# EAGLE schematic main (EAGLE 7.2.0)
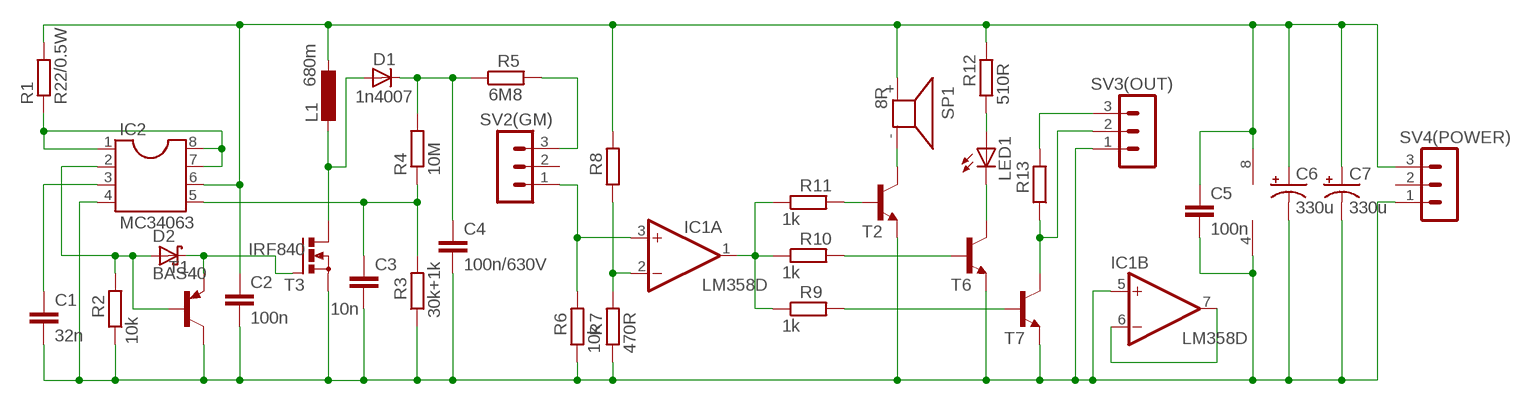
[diagram p0: schematic, sheet 1]

## Parts
C1  32n  C-EU050-025X075  [C050-025X075]
C2  100n  C-EUC3216  [C3216]
C3  10n  C-EU050-025X075  [C050-025X075]
C4  100n/630V  C-EU102-064X133  [C102-064X133]
C5  100n  C-EUC3216  [C3216]
C6  330u  CPOL-USA/3216-18W  [A/3216-18W]
C7  330u  CPOL-USA/3216-18W  [A/3216-18W]
D1  1n4007  1N4004  [DO41-10]
D2  BAS40  [SOT23]
IC1  LM358D  [SO08]
IC2  MC34063  DIL8  [DIL08]
L1  680m  L-EU0207/5V  [0207/5V]
LED1  LEDSFH482  [SFH482]
R1  R22/0.5W  R-EU_0207/5V  [0207/5V]
R2  10k  R-EU_R1206  [R1206]
R3  30k+1k  R-EU_0207/5V  [0207/5V]
R4  10M  R-EU_0207/5V  [0207/5V]
R5  6M8  R-EU_0207/12  [0207/12]
R6  10k  R-EU_0207/5V  [0207/5V]
R7  470R  R-EU_0207/5V  [0207/5V]
R8  R-EU_R1206  [R1206]
R9  1k  R-EU_M1206  [M1206]
R10  1k  R-EU_M1206  [M1206]
R11  1k  R-EU_M1206  [M1206]
R12  510R  R-EU_M1206  [M1206]
R13  R-EU_M1206  [M1206]
SP1  8R  KSS1201  [KSS1201]
SV2(GM)  MA03-1  [MA03-1]
SV3(OUT)  MA03-1  [MA03-1]
SV4(POWER)  MA03-1  [MA03-1]
T1  BC807-40-PNP-SOT23-BEC  [SOT23-BEC]
T2  BC848ALT1SMD  [SOT23]
T3  IRF840  BUZ11BV  [TO220BV]
T6  BC848ALT1SMD  [SOT23]
T7  BC848ALT1SMD  [SOT23]

## Nets
N$1: R9.2 T7.1(B)
N$2: R10.2 T6.1(B)
N$3: LED1.K(C) T6.3(C)
N$4: R13.1 SV3(OUT).2 T7.3(C)
N$5: C1.1 IC2.3
N$6: LED1.A R12.1
N$8: IC1.1(A:OUT) R9.1 R10.1 R11.1
N$9: SP1.- T2.3(C)
N$10: R11.2 T2.1(B)
N$11: IC2.1 IC2.7 IC2.8 R1.1
N$12 [hv]: C4.1 D1.C R4.2 R5.1
N$13: C3.1 IC2.5 R3.2 R4.1
N$14: D2.1(A) IC2.2 R2.2 T1.B
N$15 [hv]: D1.A L1.2 T3.D
N$16: D2.3(C) T1.E T3.G
N$17: IC1.3(A:+IN) R6.2 SV2(GM).1
N$19: IC1.2(A:-IN) R7.2 R8.1
N$20 [hv]: R5.2 SV2(GM).3
N$21: R13.2 SV3(OUT).3
N$22: IC1.6(B:-IN) IC1.7(B:OUT)
V+: C2.1 C5.1 C6.+ C7.+ IC1.8(P:V+) IC2.6 L1.1 R1.2 R8.2 R12.2 SP1.+ SV4(POWER).3
V-: C1.2 C2.2 C3.2 C4.2 C5.2 C6.- C7.- IC1.4(P:V-) IC1.5(B:+IN) IC2.4 R2.1 R3.1 R6.1 R7.1 SV3(OUT).1 SV4(POWER).1 T1.C T2.2(E) T3.S T6.2(E) T7.2(E)
Unconnected: SV2(GM).2 SV4(POWER).2

## Library data of the parts
C1-C5 = resistor:C-EU: CAPACITOR, European symbol
C6 C7 = resistor:CPOL-US: POLARIZED CAPACITOR, American symbol
D1 = diode:1N4004: DIODE general purpose rectifier, 1 A
D2 = diode:BAS40: Silicon Schottky Diodes General-purpose diode for high-speed switching
IC1 = linear:LM358: OP AMP also LM158; LM258; LM2904 Source: http://cache.national.com/ds/LM/LM158.pdf
IC2 = ic-package:DIL8: Dual In Line / Socket
L1 = resistor:L-EU: INDUCTOR, European symbol
LED1 = led:LED: LED OSRAM: - CHIPLED LG R971, LG N971, LY N971, LG Q971, LY Q971, LO R971, LY R971 LH N974, LH R974 LS Q976, LO Q976, LY Q976 LO Q996 - Hyper CHIPLED LW Q18S LB Q993, LB Q99A, LB R99A - SideLED LS A670, LO A670, LY A670, LG A670, LP A670 LB A673, LV A673, LT A673, LW A673 LH A674 LY A675 LS A676, LA A676, LO A676, LY A676, LW A676 LS A679, LY A679, LG A679 - Hyper Micro SIDELED® LS Y876, LA Y876, LO Y876, LY Y876 LT Y87S - SmartLED LW L88C, LW L88S LB L89C, LB L89S, LG L890 LS L89K, LO L89K, LY L89K LS L896, LA L896, LO L896, LY L896 - TOPLED LS T670, LO T670, LY T670, LG T670, LP T670 LSG T670, LSP T670, LSY T670, LOP T670, LYG T670 LG T671, LOG T671, LSG T671 LB T673, LV T673, LT T673, LW T673 LH T674 LS T676, LA T676, LO T676, LY T676, LB T676, LH T676, LSB T676, LW T676 LB T67C, LV T67C, LT T67C, LS T67K, LO T67K, LY T67K, LW E67C LS E67B, LA E67B, LO E67B, LY E67B, LB E67C, LV E67C, LT E67C LW T67C LS T679, LY T679, LG T679 LS T770, LO T770, LY T770, LG T770, LP T770 LB T773, LV T773, LT T773, LW T773 LH T774 LS E675, LA E675, LY E675, LS T675 LS T776, LA T776, LO T776, LY T776, LB T776 LHGB T686 LT T68C, LB T68C - Hyper Mini TOPLED® LB M676 - Mini TOPLED Santana® LG M470 LS M47K, LO M47K, LY M47K Source: http://www.osram.convergy.de LUXEON: - LUMILED® LXK2-PW12-R00, LXK2-PW12-S00, LXK2-PW14-U00, LXK2-PW14-V00 LXK2-PM12-R00, LXK2-PM12-S00, LXK2-PM14-U00 LXK2-PE12-Q00, LXK2-PE12-R00, LXK2-PE12-S00, LXK2-PE14-T00, LXK2-PE14-U00 LXK2-PB12-K00, LXK2-PB12-L00, LXK2-PB12-M00, LXK2-PB14-N00, LXK2-PB14-P00, LXK2-PB14-Q00 LXK2-PR12-L00, LXK2-PR12-M00, LXK2-PR14-Q00, LXK2-PR14-R00 LXK2-PD12-Q00, LXK2-PD12-R00, LXK2-PD12-S00 LXK2-PH12-R00, LXK2-PH12-S00 LXK2-PL12-P00, LXK2-PL12-Q00, LXK2-PL12-R00 Source: www.luxeon.com KINGBRIGHT: KA-3528ASYC Source: www.kingbright.com
R1-R13 = resistor:R-EU_: RESISTOR, European symbol
SP1 = buzzer:KSS1201: SPEAKER Source: Schukat; OC_FARNELL: unknown; OC_NEWARK: unknown
SV2(GM) SV3(OUT) SV4(POWER) = con-lstb:MA03-1: PIN HEADER; OC_FARNELL: unknown; OC_NEWARK: unknown
T1 = transistor:*-PNP-: PNP Transistror
T2 T6 T7 = transistor-npn:BC848*: NPN Transistor
T3 = transistor-power:BUZ11: N-CHANNEL MOS FET

## Net classes
1 hv: clearance 0.584 mm